# Altium schematic sheet Charger.SchDoc
size A
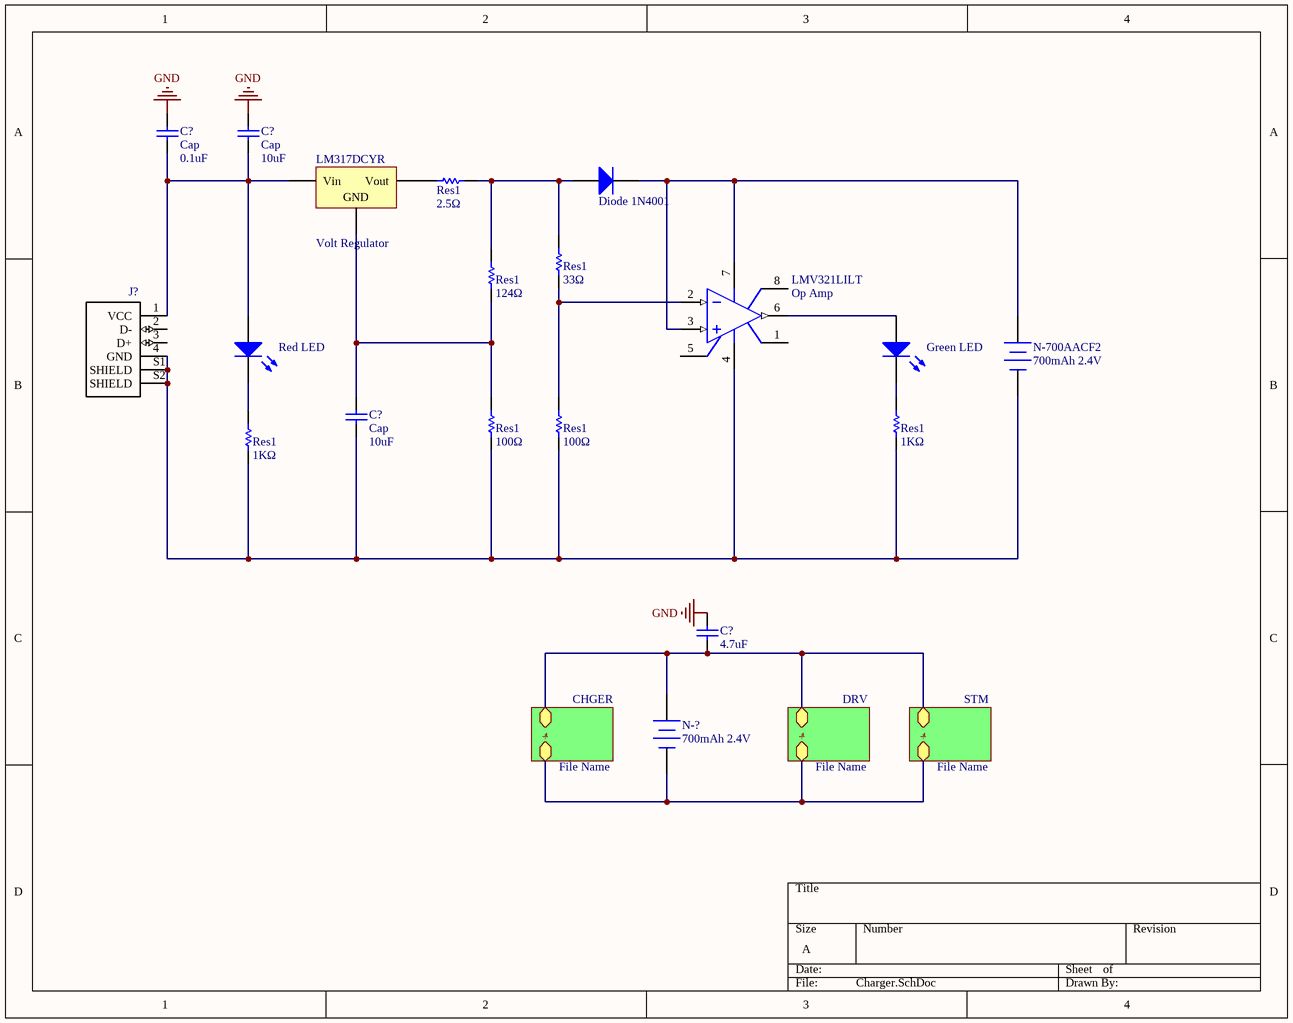
[diagram p0: Charger.SchDoc]

## Parts
(Parts that share a designator on the sheet are numbered #1, #2 ... from top to bottom, then left to right.)
?#1  Res1  value 2.5Ω  [AXIAL-0.3]
?#2  Diode 1N4001  [DO-41]
?#3  Res1  value 33Ω  [AXIAL-0.3]
?#4  Res1  value 124Ω  [AXIAL-0.3]
?#5  Res1  value 100Ω  [AXIAL-0.3]
?#6  Res1  value 100Ω  [AXIAL-0.3]
?#7  Res1  value 1KΩ  [AXIAL-0.3]
?#8  Res1  value 1KΩ  [AXIAL-0.3]
C?#1  Cap  value 0.1uF  [RAD-0.3]
C?#2  Cap  value 10uF  [RAD-0.3]
C?#3  Cap  value 10uF  [RAD-0.3]
C?#4  value 4.7uF  [RAD-0.3]  (hidden comment: Cap)
Green_LED  (no value)  [3.2X1.6X1.1]
J?  1-1734028-1  [*TE_1-1734028-1_1-1734028-1(Primary)]  (value not drawn)
LM317DCYR  Volt Regulator  [D2PAK_L]
LMV321LILT  Op Amp  [H-08A]
N-700AACF2  700mAh 2.4V  [BAT-2]
N-?  700mAh 2.4V  [BAT-2]
Red_LED  (no value)  [LED-1]

## Sub-sheets
CHGER = File Name: +, -
DRV = File Name: +, -
STM = File Name: +, -

## Nets
GND: C?#1.2 C?#2.2 C?#4.1
Net?#1_1: ?#1.1 LM317DCYR.3(Vout)
Net?#1_2: ?#1.2 ?#2.1(A) ?#3.2 ?#4.2
Net?#2_2: ?#2.2(K) LMV321LILT.3(IN+) LMV321LILT.7(V+) N-700AACF2.1(+)
Net?#3_1: ?#3.1 ?#6.2 LMV321LILT.2(IN-)
Net?#4_1: ?#4.1 ?#5.2 C?#3.2 LM317DCYR.2(GND)
Net?#5_1: ?#5.1 ?#6.1 ?#7.1 ?#8.1 C?#3.1 J?.4(GND) J?.S1(SHIELD) J?.S2(SHIELD) LMV321LILT.4(V-) N-700AACF2.2(-)
Net?#7_2: ?#7.2 Green_LED.2(K)
Net?#8_2: ?#8.2 Red_LED.2(K)
NetC?#1_1: C?#1.1 C?#2.1 J?.1(VCC) LM317DCYR.1(Vin) Red_LED.1(A)
NetC?#4_2: C?#4.2 N-?.1(+) ; sheet STM/+, sheet DRV/+, sheet CHGER/+
NetGreen_LED_1: Green_LED.1(A) LMV321LILT.6(OUT)
NetN-?_2: N-?.2(-) ; sheet STM/-, sheet DRV/-, sheet CHGER/-

Not connected (* = marked no-connect by the designer): J? 2(D-) 3(D+); LMV321LILT 1(OS_NUL) 5(OS_NUL) 8(TAB)

## Library data of the parts
?#1 ?#3-?#8 = Res1: Resistor; Published: 8-Jun-2000; LatestRevisionDate: 17-Jul-2002; LatestRevisionNote: Re-released for DXP Platform.; PackageReference: AXIAL-0.3; Publisher: Altium Limited; PackageDescription: Axial Device, Thru-Hole; 2 Leads; 0.3 in Pin Spacing
?#2 = Diode 1N4001: 1 Amp General Purpose Rectifier; Published: 8-Jun-2000; LatestRevisionDate: 17-Jul-2002; LatestRevisionNote: Re-released for DXP Platform.; DatasheetVersion: 1998; PackageVersion: Aug-1999; PackageReference: DO-41; Publisher: Altium Limited; PackageDescription: Diode, Axial; Body 5.2 x 2.7 mm (LxDia. max), Lead Dia. 0.86 mm (max); Code_JEDEC: DO-204-AL; ComponentLink1Description: Manufacturer Link; ComponentLink1URL: http://www.fairchildsemi.com/; ComponentLink2Description: Datasheet; ComponentLink2URL: http://www.fairchildsemi.com/ds/1N%2F1N4001.pdf
C?#1-C?#4 = Cap: Capacitor; Published: 8-Jun-2000; LatestRevisionDate: 17-Jul-2002; LatestRevisionNote: Re-released for DXP Platform.; PackageReference: RAD-0.3; Publisher: Altium Limited; PackageDescription: Radial Cap, Thru-Hole; 2 Leads; 0.3 in Pin Spacing
Green_LED = LED2: Typical RED, GREEN, YELLOW, AMBER GaAs LED; Published: 8-Jun-2000; LatestRevisionDate: 17-Jul-2002; LatestRevisionNote: Re-released for DXP Platform.; PackageVersion: Feb-2002; PackageReference: 3.2X1.6X1.1; Publisher: Altium Limited; PackageDescription: SM LED; 2 Flat Leads
J? = 1-1734028-1: USB CONN,Plug R/A SMT,Post 1.1,Reel; Product_Type: Connector; Centerline_Pitch: 2 mm[.078 in]; Number_of_Positions: 4; MF: TE Connectivity; Price: None; SnapEDA_Link: https://www.snapeda.com/parts/1-1734028-1/TE%20Connectivity%20AMP%20Connectors/view-part/?ref=snap; MP: 1-1734028-1; Availability: Unavailable; Package: None; TE_purchase_URL: https://www.te.com/usa-en/product-1-1734028-1.html?te_bu=Cor&te_type=disp&te_campaign=seda_glo_cor-seda-global-disp-prtnr-fy19-seda-model-bom-cta_sma-317_1&elqCampaignId=32493; Value: *
LM317DCYR = Volt Reg: Voltage Regulator; Published: 24-Mar-1999; LatestRevisionDate: 29-May-2009; LatestRevisionNote: IPC-7351 Footprint Added.; PackageReference: D2PAK; Publisher: Altium Limited; PackageDescription: 3-Pin Transistor Outline Package 2.54 mm Pitch, 15.1 mm Lead Span
LMV321LILT = Op Amp: FET Operational Amplifier; Published: 8-Jun-2000; LatestRevisionDate: 17-Jul-2002; LatestRevisionNote: Re-released for DXP Platform.; DatasheetVersion: REV. B; PackageVersion: 1990; PackageReference: H-08A; Publisher: Altium Limited; PackageDescription: Can; 8 Leads; Pin Circle Dia. 5.08 mm; Lead Dia. 0.53 mm (max); ComponentLink1Description: Manufacturer Link; ComponentLink1URL: http://www.analog.com/
N-700AACF2 N-? = Battery: Multicell Battery; Published: 24-Mar-1999; LatestRevisionDate: 17-Jul-2002; LatestRevisionNote: Re-released for DXP Platform.; PackageReference: BAT-2; Publisher: Altium Limited; PackageDescription: Battery; 2 Leads
Red_LED = LED1: Typical RED GaAs LED; Published: 8-Jun-2000; LatestRevisionDate: 08-Jul-2005; LatestRevisionNote: Mech Layer 1 removed.; PackageReference: LED-1; Publisher: Altium Limited; PackageDescription: LED; 2 Leads